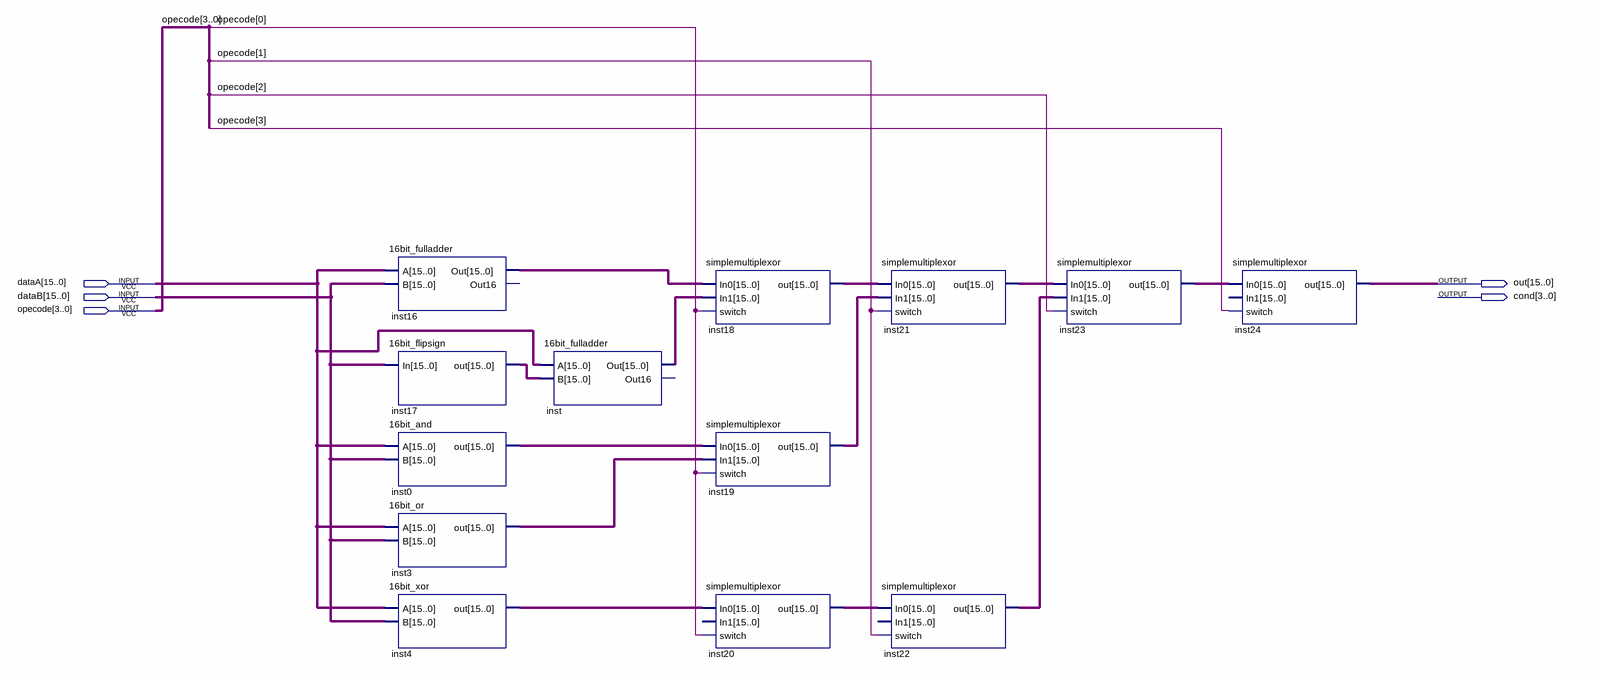
[diagram p0: schematic sheet]
// Quartus schematic ALU.bdf as structural Verilog: 13 symbols, 5 pins
module ALU (
  input  [15:0] dataA,
  input  [15:0] dataB,
  input  [3:0] opecode,
  output [15:0] out,
  output [3:0] cond
);

  wire [15:0] inst0_out, inst3_out, inst4_out, inst16_out, inst17_out, inst18_out, inst19_out, inst20_out,
       inst21_out, inst22_out, inst23_out, inst_out;

  \16bit_fulladder  inst16 (.A(dataA), .B(dataB), .Out(inst16_out));  // open: Out16
  \16bit_flipsign  inst17 (.In(dataB), .out(inst17_out));
  \16bit_and  inst0 (.A(dataA), .B(dataB), .out(inst0_out));
  \16bit_or  inst3 (.A(dataA), .B(dataB), .out(inst3_out));
  \16bit_xor  inst4 (.A(dataA), .B(dataB), .out(inst4_out));
  \16bit_fulladder  inst (.A(dataA), .B(inst17_out), .Out(inst_out));  // open: Out16
  simplemultiplexor inst18 (.In0(inst16_out), .In1(inst_out), .switch(opecode[0]), .out(inst18_out));
  simplemultiplexor inst19 (.In0(inst0_out), .In1(inst3_out), .switch(opecode[0]), .out(inst19_out));
  simplemultiplexor inst20 (.In0(inst4_out), .switch(opecode[0]), .out(inst20_out));  // open: In1
  simplemultiplexor inst21 (.In0(inst18_out), .In1(inst19_out), .switch(opecode[1]), .out(inst21_out));
  simplemultiplexor inst22 (.In0(inst20_out), .switch(opecode[1]), .out(inst22_out));  // open: In1
  simplemultiplexor inst23 (.In0(inst21_out), .In1(inst22_out), .switch(opecode[2]), .out(inst23_out));
  simplemultiplexor inst24 (.In0(inst23_out), .switch(opecode[3]), .out(out));  // open: In1
endmodule
